# Altium schematic sheet PF8_AudioOutput.SchDoc
size A
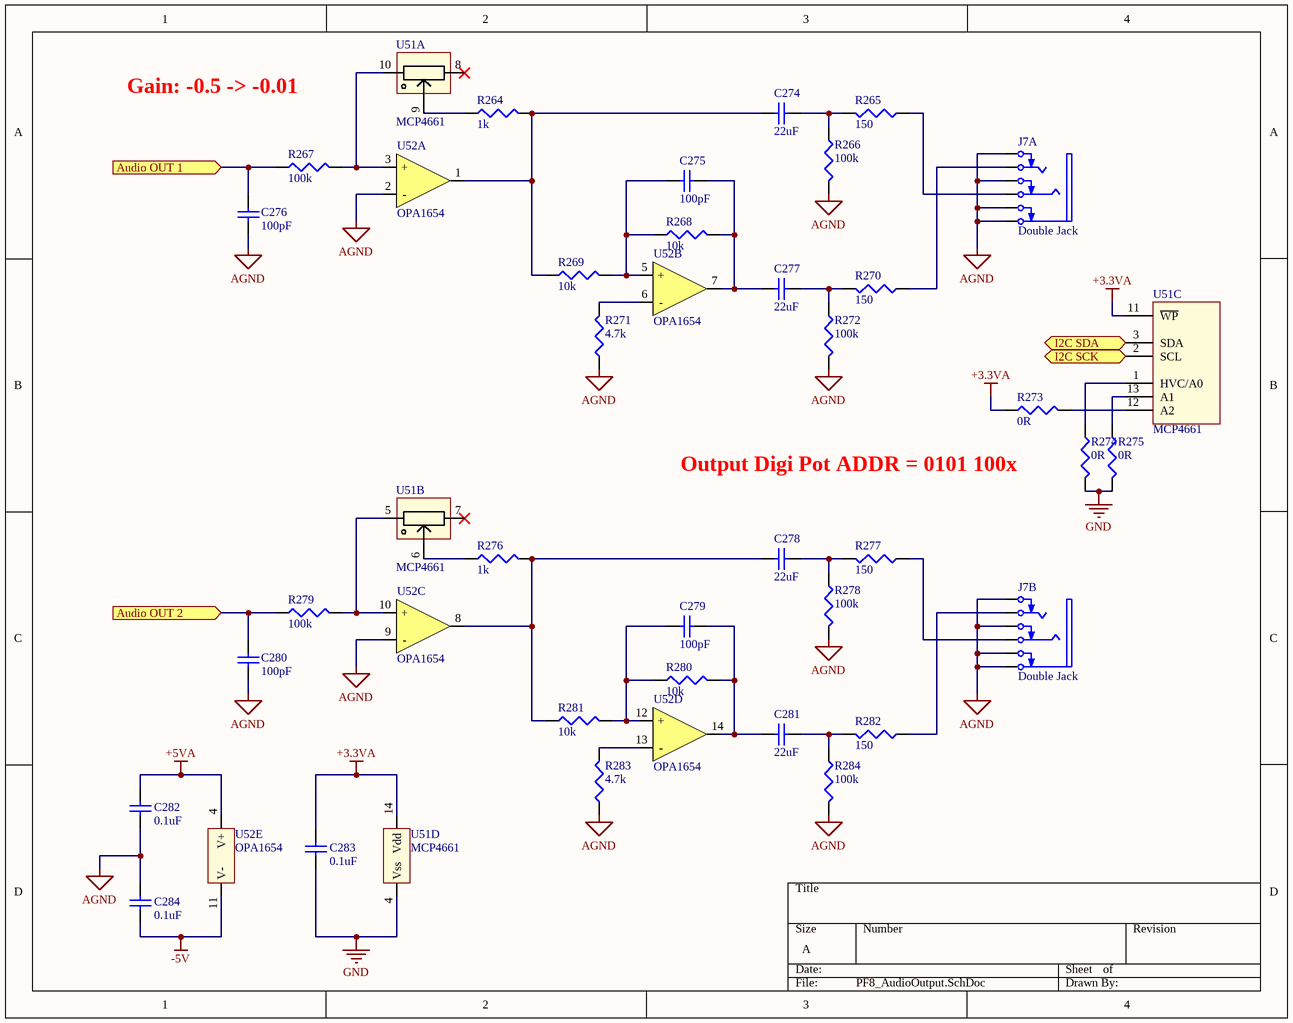
[diagram p0: PF8_AudioOutput.SchDoc]

## Parts
C274  22uF  [CAPC1608X08]
C275  100pF  [CAPC1608X08]
C276  100pF  [CAPC1608X08]
C277  22uF  [CAPC1608X08]
C278  22uF  [CAPC1608X08]
C279  100pF  [CAPC1608X08]
C280  100pF  [CAPC1608X08]
C281  22uF  [CAPC1608X08]
C282  0.1uF  [CAPC1608X08]
C283  0.1uF  [CAPC1608X08]
C284  0.1uF  [CAPC1608X08]
J7  Double Jack  [Amphenol_ACJS-MHDC]  (parts A,B of 2)
R264  1k  [RESC1608X05]
R265  150  [RESC1608X05]
R266  100k  [RESC1608X05]
R267  100k  [RESC1608X05]
R268  10k  [RESC1608X05]
R269  10k  [RESC1608X05]
R270  150  [RESC1608X05]
R271  4.7k  [RESC1608X05]
R272  100k  [RESC1608X05]
R273  0R  [RESC1608X05]
R274  0R  [RESC1608X05]
R275  0R  [RESC1608X05]
R276  1k  [RESC1608X05]
R277  150  [RESC1608X05]
R278  100k  [RESC1608X05]
R279  100k  [RESC1608X05]
R280  10k  [RESC1608X05]
R281  10k  [RESC1608X05]
R282  150  [RESC1608X05]
R283  4.7k  [RESC1608X05]
R284  100k  [RESC1608X05]
U51  MCP4661  [TSSOP14_MC-M]  (parts A,B,C,D of 4)
U52  OPA1654  [D14-M]  (parts A,B,C,D,E of 5)

## Ports
Audio OUT 1 (in), Audio OUT 2 (in), I2C SCK, I2C SDA

## Nets
+3.3VA: C283.1 R273.1 U51.11(~{WP}) U51.14(Vdd)
+5VA: C282.1 U52.4(V+)
-5V: C284.2 U52.11(V-)
AGND: C276.1 C280.1 C282.2 C284.1 J7.1(SB) J7.2(RB) J7.3(TB) J7.4(S) J7.7(SB) J7.8(RB) J7.9(TB) J7.10(S) R266.2 R271.1 R272.2 R278.2 R283.1 R284.2 U52.2(-) U52.9(-)
GND: C283.2 R274.2 R275.2 U51.4(Vss)
Audio OUT 1: C276.2 R267.1 ; port Audio OUT 1
Audio OUT 2: C280.2 R279.1 ; port Audio OUT 2
I2C SCK: U51.2(SCL) ; port I2C SCK
I2C SDA: U51.3(SDA) ; port I2C SDA
NetC274_1: C274.1 R265.2 R266.1
NetC274_2: C274.2 R264.2 R269.1 U52.1(OUT)
NetC275_1: C275.1 C277.2 R268.2 U52.7(OUT)
NetC275_2: C275.2 R268.1 R269.2 U52.5(+)
NetC277_1: C277.1 R270.2 R272.1
NetC278_1: C278.1 R277.2 R278.1
NetC278_2: C278.2 R276.2 R281.1 U52.8(OUT)
NetC279_1: C279.1 C281.2 R280.2 U52.14(OUT)
NetC279_2: C279.2 R280.1 R281.2 U52.12(+)
NetC281_1: C281.1 R282.2 R284.1
NetJ7_5: J7.5(R) R277.1
NetJ7_6: J7.6(T) R282.1
NetJ7_11: J7.11(R) R265.1
NetJ7_12: J7.12(T) R270.1
NetR264_1: R264.1 U51.9(P0W)
NetR267_2: R267.2 U51.10(P0B) U52.3(+)
NetR271_2: R271.2 U52.6(-)
NetR273_2: R273.2 U51.12(A2)
NetR274_1: R274.1 U51.1(HVC/A0)
NetR275_1: R275.1 U51.13(A1)
NetR276_1: R276.1 U51.6(P1W)
NetR279_2: R279.2 U51.5(P1B) U52.10(+)
NetR283_2: R283.2 U52.13(-)

Not connected (* = marked no-connect by the designer): U51 7(P1A)* 8(P0A)*

## Notes on the sheet
- Gain: -0.5 -> -0.01
- Output Digi Pot ADDR = 0101 100x

## Library data of the parts
C274 C277 C278 C281 = Cap Semi: Capacitor (Semiconductor SIM Model); Fabricant: MURATA; Fournisseur: Farnell; RefFabricant: GRM188R60J226MEA0D; RefFournisseur: 2666490; Value: 22uF; Case: 0603 [1608 Metric]; DataSheet: http://www.farnell.com/datasheets/1910934.pdf
C275 C276 C279 C280 = Cap Semi: Capacitor (Semiconductor SIM Model); Fabricant: MURATA; Fournisseur: Farnell; RefFabricant: GRT1885C1H101JA02D; RefFournisseur: 2672133; Value: 100pF; Case: 0603 [1608 Metric]; DataSheet: http://www.farnell.com/datasheets/2165936.pdf
C282-C284 = Cap Semi: Capacitor (Semiconductor SIM Model); Fabricant: MURATA; Fournisseur: Farnell; RefFabricant: GRM188F51E104ZA01D; RefFournisseur: 2821272; Value: 0.1uF; Case: 0603 [1608 Metric]; DataSheet: http://www.farnell.com/datasheets/2048672.pdf
J7 = Dual TRS Jack Bypassed: Dual Jack stereo bypassed; Fabricant: AMPHENOL; Fournisseur: Farnell; RefFabricant: ACJS-MHDC; RefFournisseur: 2771861; DataSheet: http://www.farnell.com/datasheets/866888.pdf
R264 R276 = Res3: Resistor; Fabricant: TE CONNECTIVITY; Fournisseur: Farnell; RefFabricant: CPF-A-0603B1K0E1; RefFournisseur: 2483880; Value: 1k; Case: 0603 [1608 Metric]; DataSheet: http://www.farnell.com/datasheets/1935020.pdf
R265 R270 R277 R282 = Res3: Resistor; Value: 150k; Fabricant: TE CONNECTIVITY; Fournisseur: Farnell; RefFabricant: CPF0603B150KE1; RefFournisseur: 2330937; Case: 0603 [1608 Metric]; DataSheet: http://www.farnell.com/datasheets/2104089.pdf
R266 R267 R272 R278 R279 R284 = Res3: Resistor; Fabricant: TE CONNECTIVITY; Fournisseur: Farnell; RefFabricant: RN73C1J100KBTDF; RefFournisseur: 2687850; Value: 100k; Case: 0603 [1608 Metric]; DataSheet: http://www.farnell.com/datasheets/2189072.pdf
R268 R269 R271 R280 R281 R283 = Res3: Resistor; Fabricant: TE CONNECTIVITY; Fournisseur: Farnell; RefFabricant: CPF-A-0603B4K7E1; RefFournisseur: 2483933; Case: 0603 [1608 Metric]; DataSheet: http://www.farnell.com/datasheets/1935020.pdf
  R268 R269 R280 R281: Value: 10k
  R271 R283: Value: 4.7k
R273-R275 = Res3: Resistor; Value: 0; Case: 0603 [1608 Metric]
U51 = MCP4661: Dual DigiPot non volatile I2C; RefFournisseur: 1840724; RefFabricant: MCP4661-503E/ST; Fournisseur: Farnell; Fabricant: MICROCHIP; DataSheet: http://www.farnell.com/datasheets/2243913.pdf
U52 = OPA1654: Quad Audio OpAmp; Fabricant: TEXAS INSTRUMENTS; RefFournisseur: 2099889; Fournisseur: Farnell; RefFabricant: OPA1654; DataSheet: http://www.ti.com/lit/ds/symlink/opa1654.pdf